# EAGLE design Lemming_SMD (EAGLE 9.5.2)
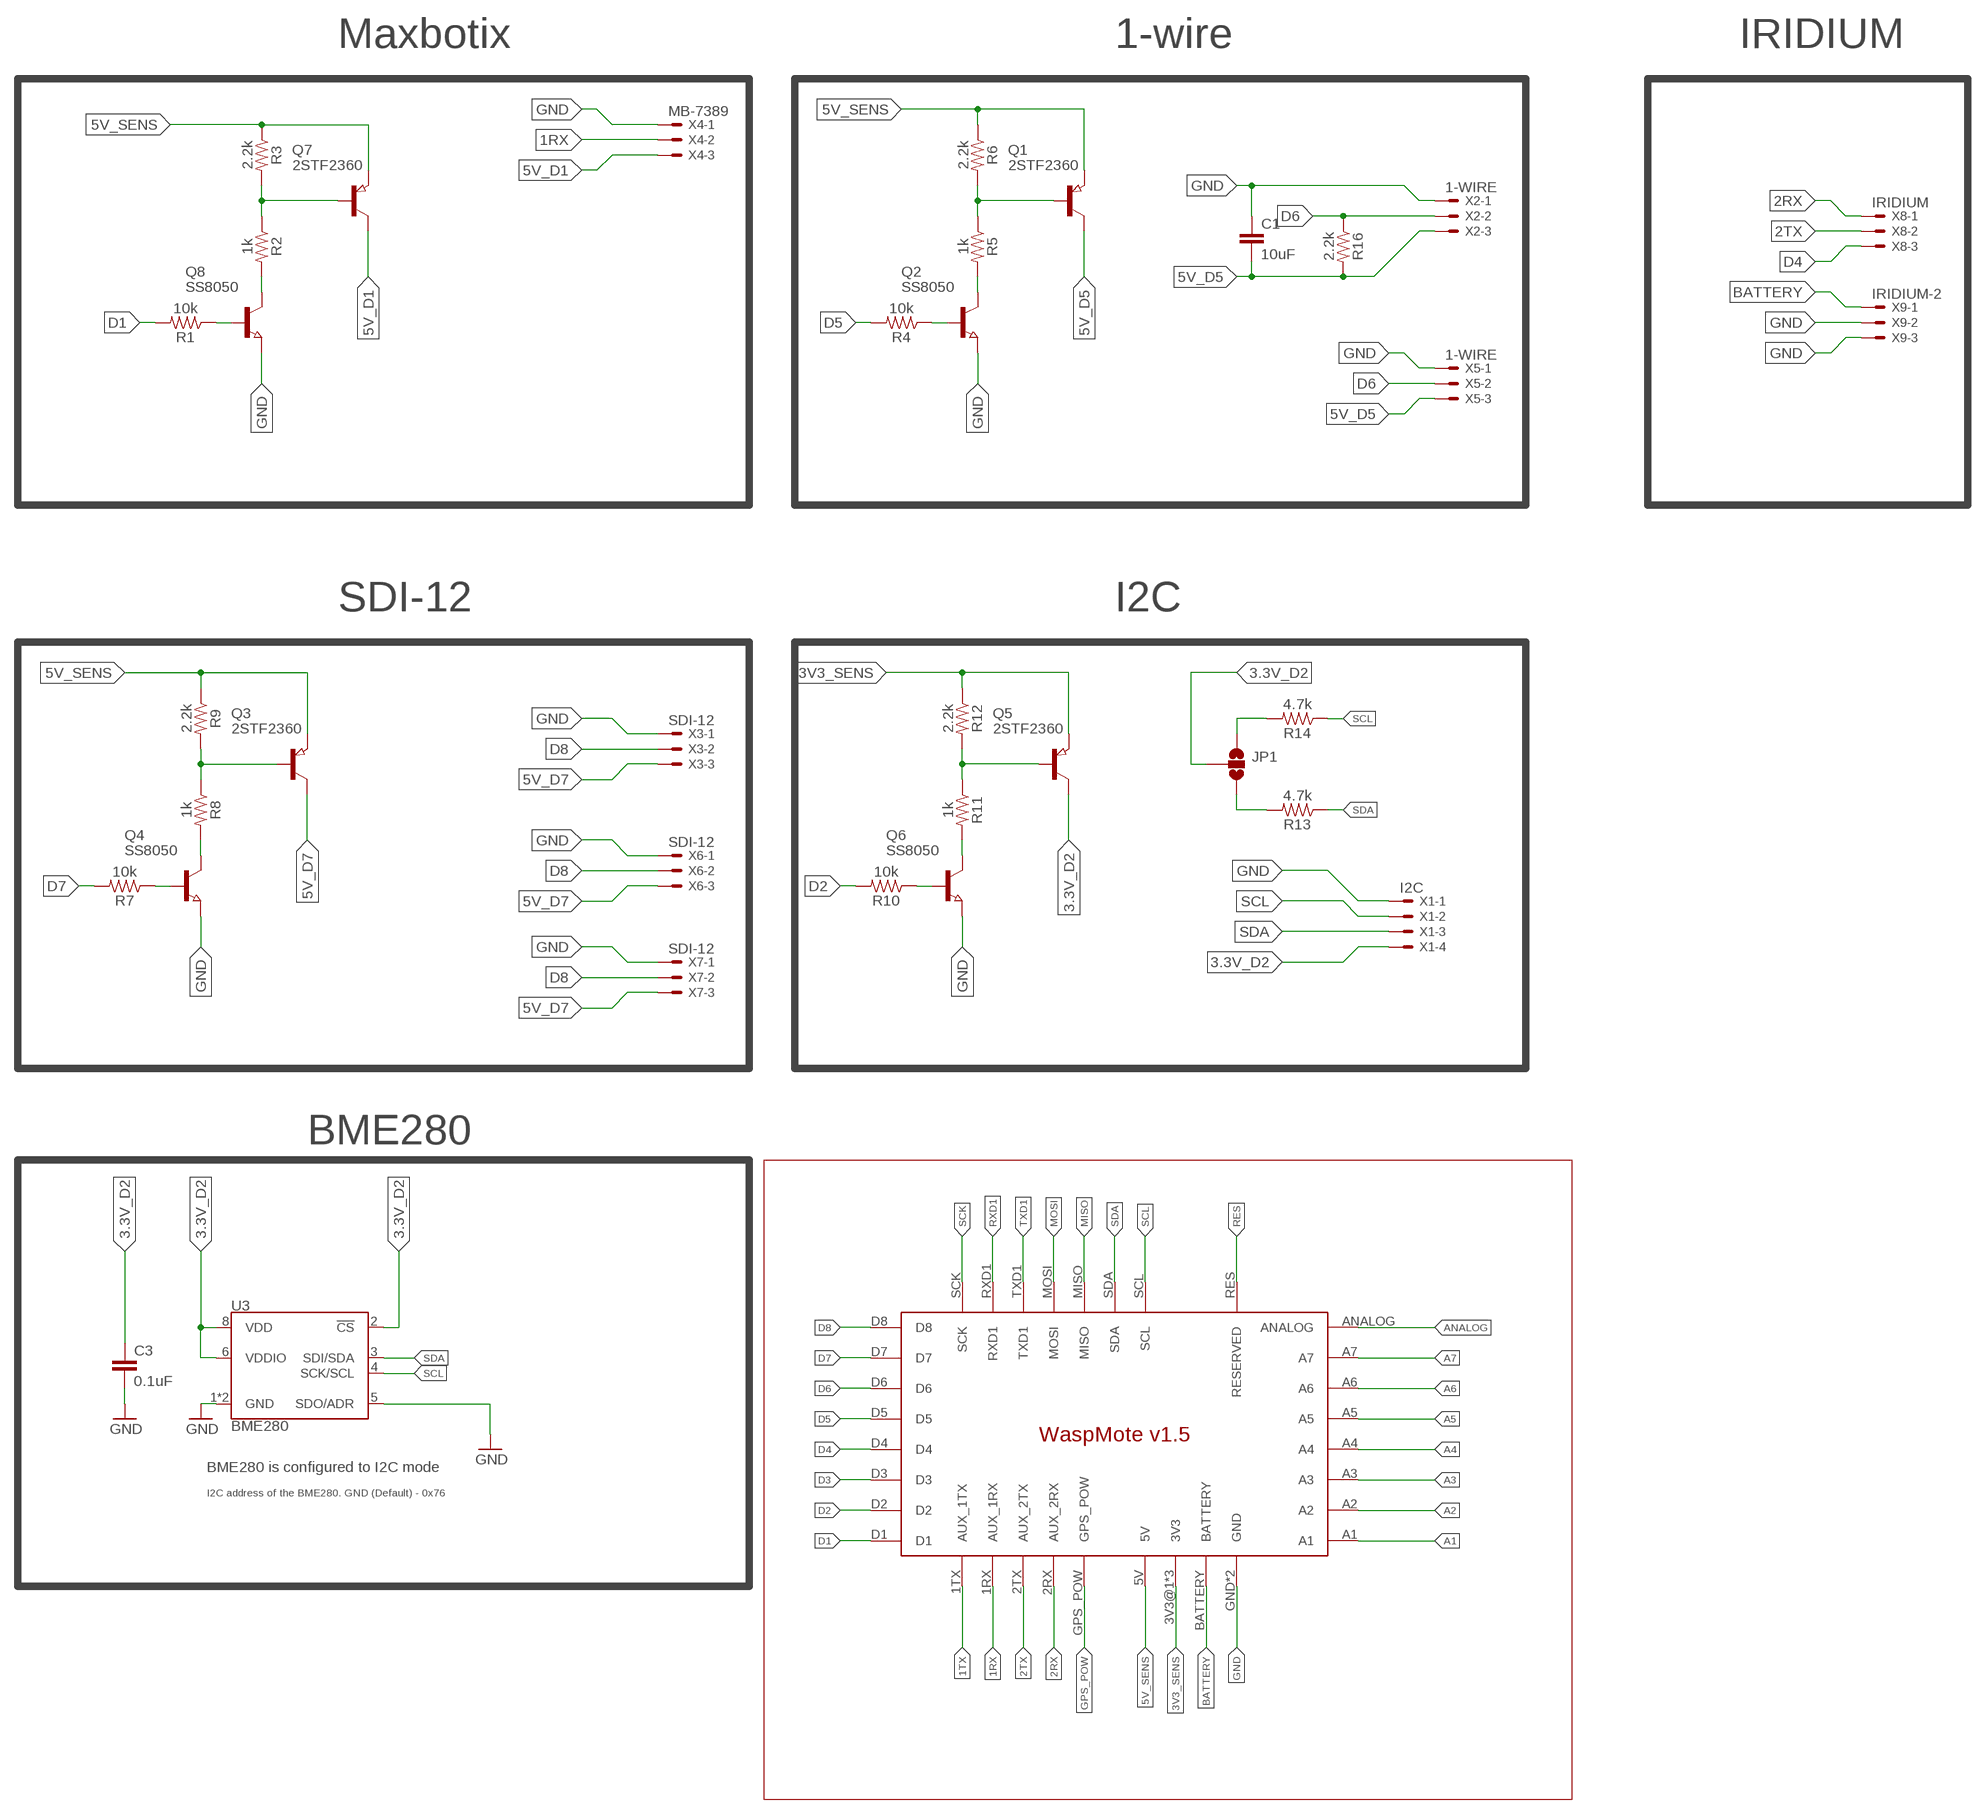
[diagram p0: schematic, sheet 1]

## Parts
C1  10uF  0.1UF-0603-25V-(+80/-20%)  [0603]
C3  0.1uF  0.1UF-0603-25V-(+80/-20%)  [0603]
JP1  JUMPER-SMT_3_NO_SILK  [SMT-JUMPER_3_NO_SILK]
Q1  2STF2360  PNP-TRANSISTOR_SOT89  [SOT89]
Q2  SS8050  NPN-TRANSISTOR_SOT23  [SOT23]
Q3  2STF2360  PNP-TRANSISTOR_SOT89  [SOT89]
Q4  SS8050  NPN-TRANSISTOR_SOT23  [SOT23]
Q5  2STF2360  PNP-TRANSISTOR_SOT89  [SOT89]
Q6  SS8050  NPN-TRANSISTOR_SOT23  [SOT23]
Q7  2STF2360  PNP-TRANSISTOR_SOT89  [SOT89]
Q8  SS8050  NPN-TRANSISTOR_SOT23  [SOT23]
R1  10k  4.7KOHM-0603-1/10W-1%  [0603]
R2  1k  4.7KOHM-0603-1/10W-1%  [0603]
R3  2.2k  4.7KOHM-0603-1/10W-1%  [0603]
R4  10k  4.7KOHM-0603-1/10W-1%  [0603]
R5  1k  4.7KOHM-0603-1/10W-1%  [0603]
R6  2.2k  4.7KOHM-0603-1/10W-1%  [0603]
R7  10k  4.7KOHM-0603-1/10W-1%  [0603]
R8  1k  4.7KOHM-0603-1/10W-1%  [0603]
R9  2.2k  4.7KOHM-0603-1/10W-1%  [0603]
R10  10k  4.7KOHM-0603-1/10W-1%  [0603]
R11  1k  4.7KOHM-0603-1/10W-1%  [0603]
R12  2.2k  4.7KOHM-0603-1/10W-1%  [0603]
R13  4.7k  4.7KOHM-0603-1/10W-1%  [0603]
R14  4.7k  4.7KOHM-0603-1/10W-1%  [0603]
R16  2.2k  4.7KOHM-0603-1/10W-1%  [0603]
U3  BME280  [LGA-8-2.5X2.5]
U$1  WASPMOTE_V1.5  [WASPMOTE_V1.5]
X1  I2C  22-23-2041  [22-23-2041]
X2  1-WIRE  22-23-2031  [22-23-2031]
X3  SDI-12  22-23-2031  [22-23-2031]
X4  MB-7389  22-23-2031  [22-23-2031]
X5  1-WIRE  22-23-2031  [22-23-2031]
X6  SDI-12  22-23-2031  [22-23-2031]
X7  SDI-12  22-23-2031  [22-23-2031]
X8  IRIDIUM  22-23-2031  [22-23-2031]
X9  IRIDIUM-2  22-23-2031  [22-23-2031]

## Nets
1RX: U$1.1RX(AUX_1RX) X4.2
1TX: U$1.1TX(AUX_1TX)
2RX: U$1.2RX(AUX_2RX) X8.1
2TX: U$1.2TX(AUX_2TX) X8.2
3.3V_D2: C3.1 JP1.2 Q5.2(C) U3.2(!CS) U3.6(VDDIO) U3.8(VDD) X1.4
3V3_SENS: Q5.3(E) R12.1 U$1.3V3@1(3V3) U$1.3V3@2(3V3) U$1.3V3@3(3V3)
5V_D1: Q7.2(C) X4.3
5V_D5: C1.2 Q1.2(C) R16.2 X2.3 X5.3
5V_D7: Q3.2(C) X3.3 X6.3 X7.3
5V_SENS: Q1.3(E) Q3.3(E) Q7.3(E) R3.1 R6.1 R9.1 U$1.5V
A1: U$1.A1
A2: U$1.A2
A3: U$1.A3
A4: U$1.A4
A5: U$1.A5
A6: U$1.A6
A7: U$1.A7
ANALOG: U$1.ANALOG
BATTERY: U$1.BATTERY X9.1
D1: R1.2 U$1.D1
D2: R10.2 U$1.D2
D3: U$1.D3
D4: U$1.D4 X8.3
D5: R4.2 U$1.D5
D6: R16.1 U$1.D6 X2.2 X5.2
D7: R7.2 U$1.D7
D8: U$1.D8 X3.2 X6.2 X7.2
GND: C1.1 C3.2 Q2.2(E) Q4.2(E) Q6.2(E) Q8.2(E) U3.1(GND) U3.5(SDO/ADR) U3.7(GND) U$1.GND U$1.GND_2(GND) X1.1 X2.1 X3.1 X4.1 X5.1 X6.1 X7.1 X9.2 X9.3
GPS_POW: U$1.GPS_POW
MISO: U$1.MISO
MOSI: U$1.MOSI
N$1: Q6.1(B) R10.1
N$2: Q6.3(C) R11.2
N$3: Q5.1(B) R11.1 R12.2
N$4: Q2.1(B) R4.1
N$5: Q1.1(B) R5.1 R6.2
N$6: JP1.3 R13.2
N$7: Q3.1(B) R8.1 R9.2
N$8: Q4.3(C) R8.2
N$9: Q4.1(B) R7.1
N$10: Q8.1(B) R1.1
N$11: Q8.3(C) R2.2
N$12: Q7.1(B) R2.1 R3.2
N$13: Q2.3(C) R5.2
N$14: JP1.1 R14.2
RES: U$1.RES(RESERVED)
RXD1: U$1.RXD1
SCK: U$1.SCK
SCL: R14.1 U3.4(SCK/SCL) U$1.SCL X1.2
SDA: R13.1 U3.3(SDI/SDA) U$1.SDA X1.3
TXD1: U$1.TXD1

## Notes on the sheet
- Maxbotix | 1-wire | IRIDIUM
- SDI-12 | I2C
- BME280
- BME280 is configured to I2C mode
- I2C address of the BME280. GND (Default) - 0x76

## Library data of the parts
C1 = SparkFun-Capacitors:0.1UF: 0.1µF ceramic capacitors A capacitor is a passive two-terminal electrical component used to store electrical energy temporarily in an electric field.; PROD_ID: CAP-00810; VALUE: 0.1uF
C3 = SparkFun-Capacitors:0.1UF: 0.1µF ceramic capacitors A capacitor is a passive two-terminal electrical component used to store electrical energy temporarily in an electric field.; PROD_ID: CAP-00810
JP1 = SparkFun-Jumpers:JUMPER-SMT_3_NO: Normally open jumper This jumper has three pads in close proximity to each other. Apply solder to close the connection(s).
Q1 Q3 Q5 Q7 = semicon-smd-ipc:PNP-TRANSISTOR_: PNP TRANSISTOR
Q2 Q4 Q6 Q8 = semicon-smd-ipc:NPN-TRANSISTOR_: NPN TRANSISTOR
R1-R12 R16 = SparkFun-Resistors:4.7KOHM: 4.7kΩ resistor A resistor is a passive two-terminal electrical component that implements electrical resistance as a circuit element. Resistors act to reduce current flow, and, at the same time, act to lower voltage levels within circuits. - Wikipedia; PROD_ID: RES-07857; VALUE: 4.7k
R13 R14 = SparkFun-Resistors:4.7KOHM: 4.7kΩ resistor A resistor is a passive two-terminal electrical component that implements electrical resistance as a circuit element. Resistors act to reduce current flow, and, at the same time, act to lower voltage levels within circuits. - Wikipedia; PROD_ID: RES-07857
U3 = SparkFun-Sensors:BME280: Bosch BME280 – Combined Humidity and Pressure Sensor The BME280 is as combined digital humidity, pressure and temperature sensor based on proven sensing principles. The sensor module is housed in an extremely compact metal-lid LGA package with a footprint of only 2.5×2.5mm² with a height of 0.93mm. Its small dimensions and its low power consumption allow the implementation in battery driven devices such as handsets, GPS modules or watches. Datasheet <https://cdn.sparkfun.com/assets/learn_tutorials/4/1/9/BST-BME280_DS001-10.pdf> SparkFun Products SparkFun Atmospheric Sensor Breakout - BME280 <https://www.sparkfun.com/products/13676> (SEN-13676); PROD_ID: IC-13090
U$1 = UIO-John:WASPMOTE_V1.5: WaspMote v1.5 (c) 2017 john.hulth@geo.uio.no
X1 = con-molex:22-23-2041: .100" (2.54mm) Center Header - 4 Pin; MF: MOLEX; MPN: 22-23-2041; OC_FARNELL: 1462920; OC_NEWARK: 38C0355
X2-X9 = con-molex:22-23-2031: .100" (2.54mm) Center Header - 3 Pin; MF: MOLEX; MPN: 22-23-2031; OC_FARNELL: 1462950; OC_NEWARK: 30C0862

## Board
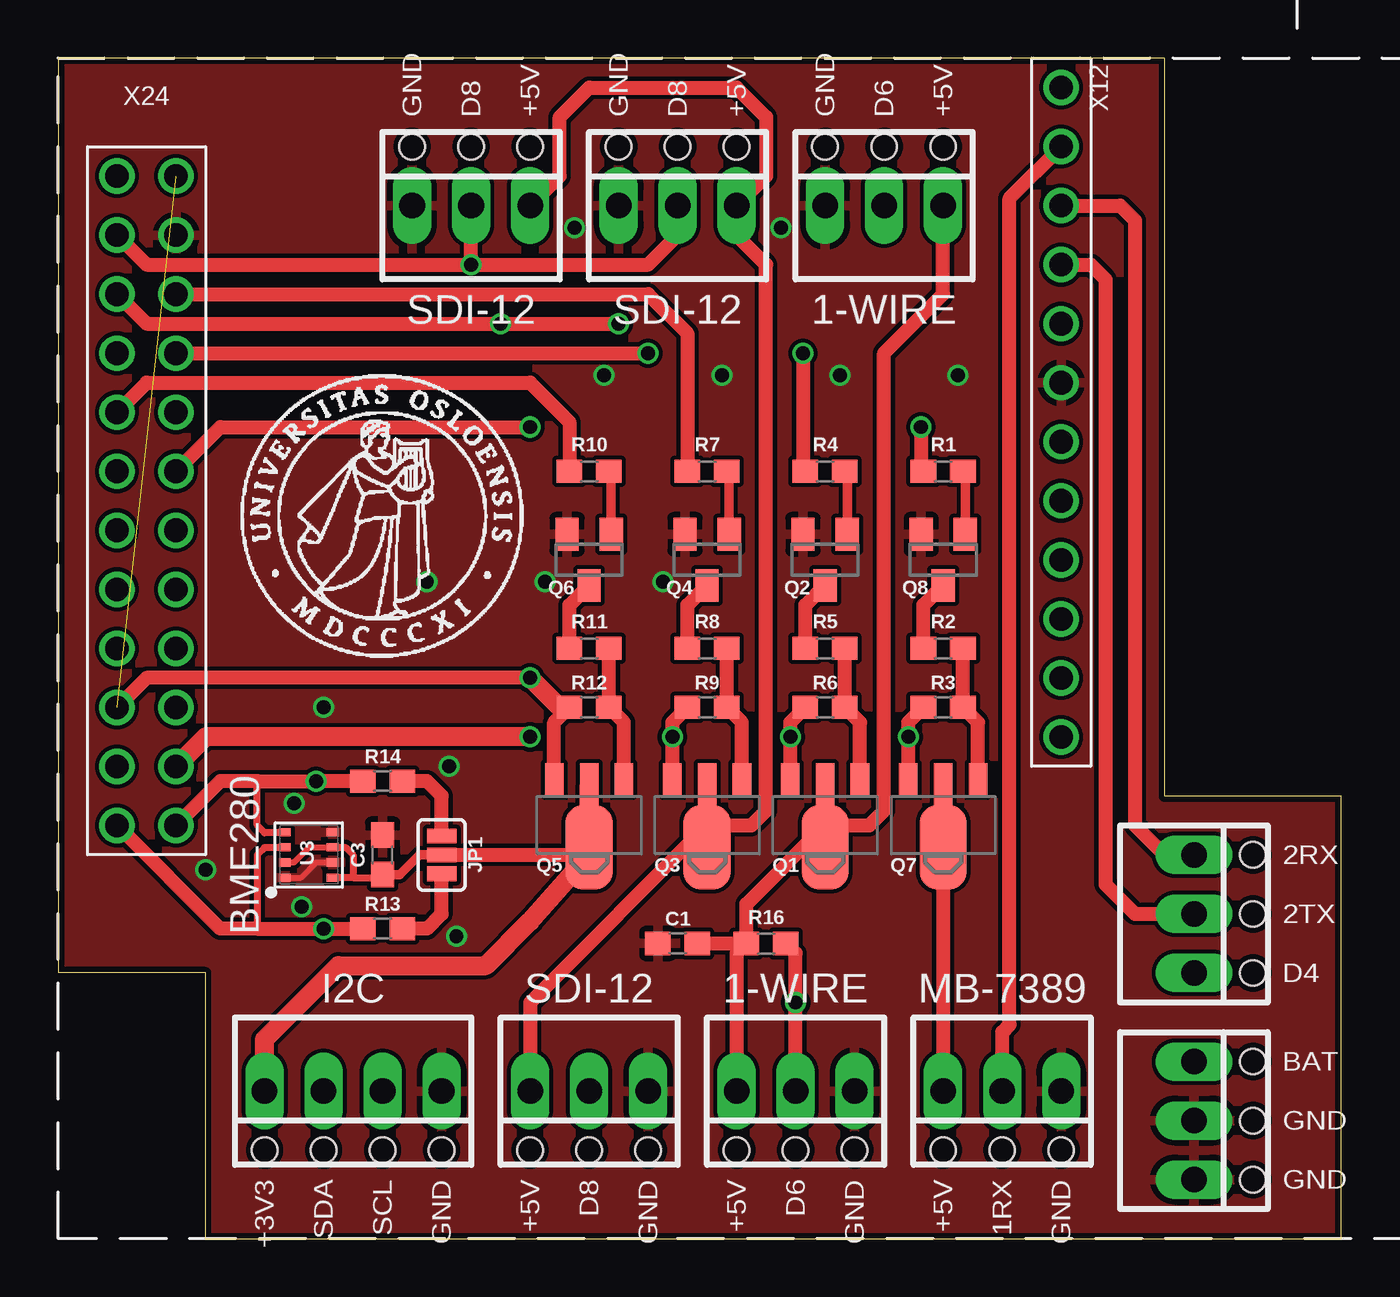
[diagram p1: board, top side]
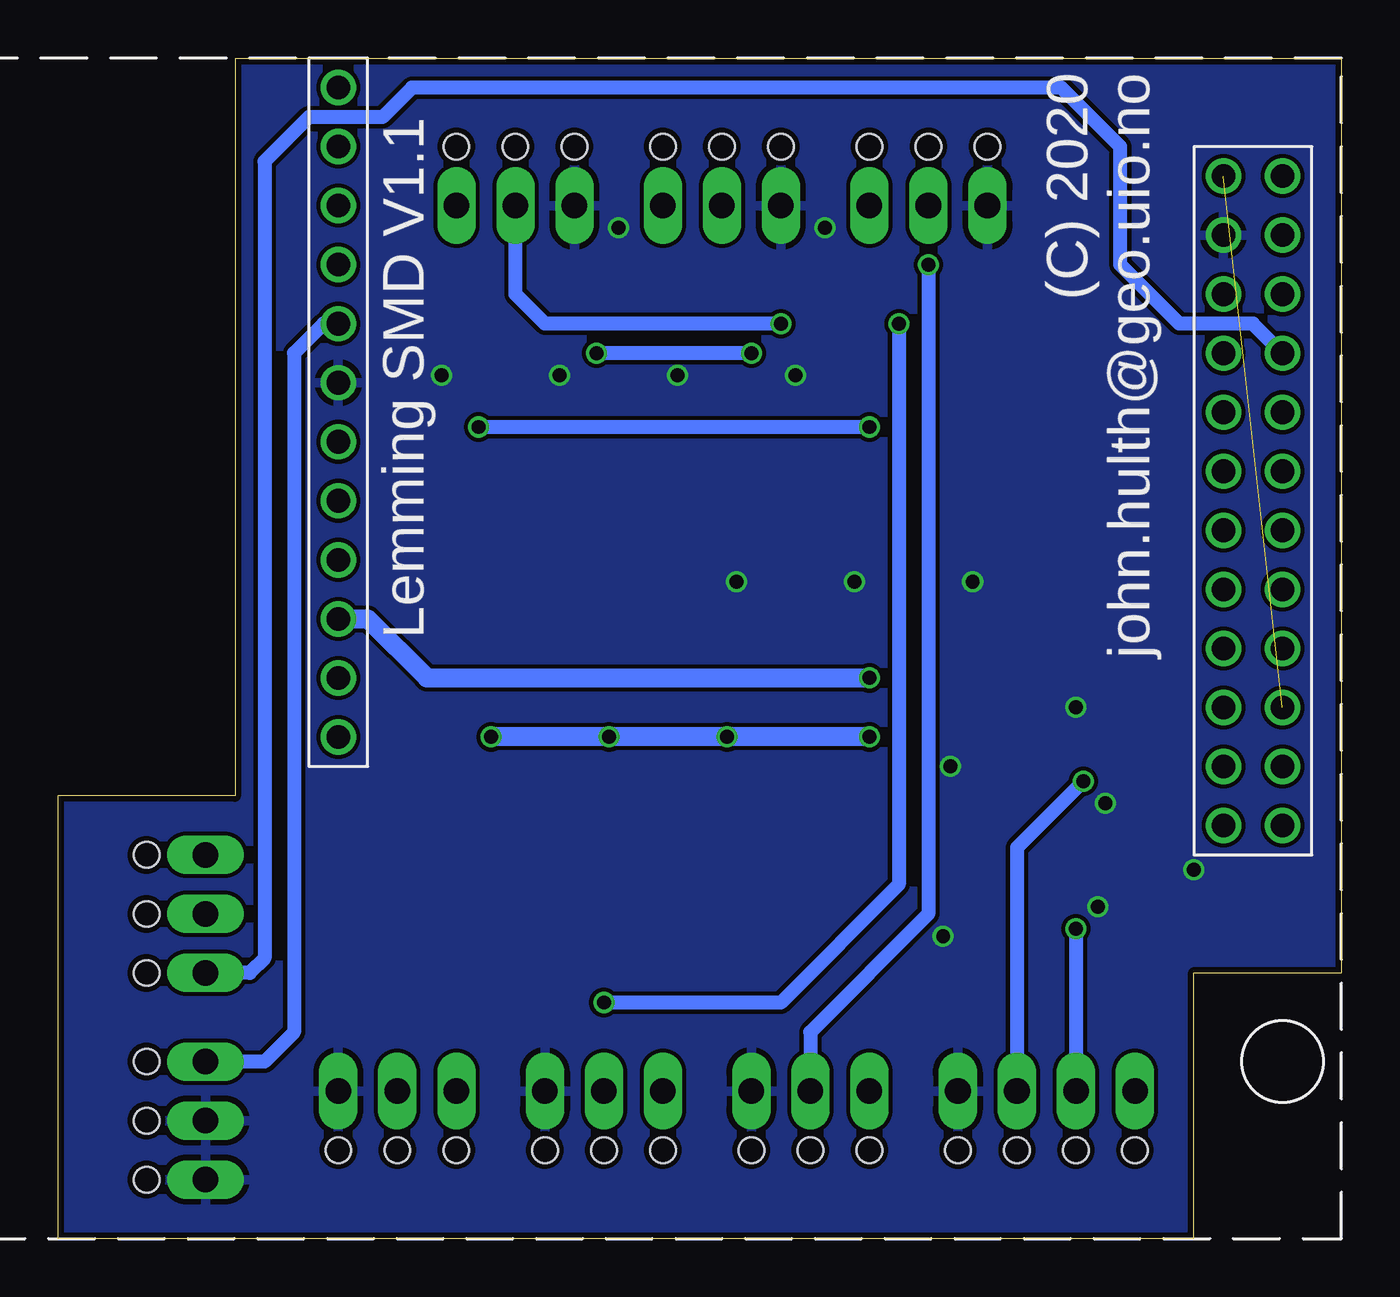
[diagram p2: board, bottom side, seen from below]

Size 55.24 x 50.8 mm. Coordinates in mm from the lower left corner, seen from the top.
Outline: 6.35,0 55.24,0 55.24,19.05 47.62,19.05 47.62,50.8 0,50.8 0,11.43 6.35,11.43 6.35,0
Copper layers (1*16): Top 0.035mm / dielectric 1.5mm / Bottom 0.035mm
Design rules "dirt_cheap_dirty_boards.v1 *": minimum track width 5mil, minimum drill 12mil, track to track 7mil, track to pad 7mil, pad to pad 7mil, via to via 7mil, smd to smd 0mil, copper to edge 10mil, drill to drill 10mil, minimum pad ring 10mil, minimum via ring 6mil, stop-mask expansion 2mil, vias tented up to drill 25mil, thermal gap 10mil

### Footprints (pad centres in the part's own frame; a part is rotated, then mirrored left to right if it is on the bottom)
0603 = smd 1.1 x 1: 1 -0.85,0; 2 0.85,0
SMT-JUMPER_3_NO_SILK = smd 0.635 x 1.27: 1 -0.813,0; 2 0,0; 3 0.813,0
SOT89 = smd 0.8 x 1.4: 1 -1.499,-1.981; 3 1.499,-1.981 | smd 0.8 x 1.9: 2 0,-1.727 | smd 2.032 x 3.65: 2@1 0,0.94
SOT23 = smd 1 x 1.4: 1 -0.95,-1.1; 2 0.95,-1.1; 3 0,1.1
LGA-8-2.5X2.5 = smd 0.35 x 0.5: 1 -0.975,1.025; 2 -0.325,1.025; 3 0.325,1.025; 4 0.975,1.025; 5 0.975,-1.025; 6 0.325,-1.025; 7 -0.325,-1.025; 8 -0.975,-1.025
WASPMOTE_V1.5 = drill 1.016: 1RX 43.18,46.99; 1TX 43.18,49.53; 2RX 43.18,44.45; 2TX 43.18,41.91; 3V3@1 5.08,45.72; 3V3@2 2.54,22.86; 3V3@3 43.18,26.67; 5V 5.08,20.32; A1 5.08,22.86; A2 2.54,25.4; A3 5.08,25.4; A4 2.54,27.94; A5 5.08,27.94; A6 2.54,30.48; A7 5.08,30.48; ANALOG 2.54,45.72; BATTERY 43.18,39.37; D1 5.08,33.02; D2 2.54,35.56; D3 5.08,35.56; D4 2.54,38.1; D5 5.08,38.1; D6 2.54,40.64; D7 5.08,40.64; D8 2.54,43.18; GND 5.08,43.18; GND_2 43.18,36.83; GPS_POW 2.54,20.32; MISO 43.18,21.59; MOSI 43.18,24.13; RES 2.54,33.02; RXD1 43.18,31.75; SCK 43.18,34.29; SCL 5.08,17.78; SDA 2.54,17.78; TXD1 43.18,29.21
22-23-2041 = drill 1.1 pad 1.422 long: 1 -3.81,0; 2 -1.27,0; 3 1.27,0; 4 3.81,0 | hole 1.1: -3.81,2.54; -1.27,2.54; 1.27,2.54; 3.81,2.54
22-23-2031 = drill 1.1 pad 1.422 long: 1 -2.54,0; 2 0,0; 3 2.54,0 | hole 1.1: -2.54,2.54; 0,2.54; 2.54,2.54

### Placement (x,y rotation side)
C1  26.67,12.7 0 top
C3  13.97,16.51 90 top
JP1  16.51,16.51 270 top
Q1  33.02,17.78 180 top
Q2  33.02,29.21 180 top
Q3  27.94,17.78 180 top
Q4  27.94,29.21 180 top
Q5  22.86,17.78 180 top
Q6  22.86,29.21 180 top
Q7  38.1,17.78 180 top
Q8  38.1,29.21 180 top
R1  38.1,33.02 180 top
R2  38.1,25.4 180 top
R3  38.1,22.86 0 top
R4  33.02,33.02 180 top
R5  33.02,25.4 180 top
R6  33.02,22.86 0 top
R7  27.94,33.02 180 top
R8  27.94,25.4 180 top
R9  27.94,22.86 0 top
R10  22.86,33.02 180 top
R11  22.86,25.4 180 top
R12  22.86,22.86 0 top
R13  13.97,13.34 0 top
R14  13.97,19.68 0 top
R16  30.48,12.7 180 top
U3  10.79,16.51 90 top
U$1  0,0 0 top
U$3  [UIO-LOGO-BL]  7.62,24.77 0 top
X1  12.7,6.35 180 top
X2  31.75,6.35 180 top
X3  22.86,6.35 180 top
X4  40.64,6.35 180 top
X5  35.56,44.45 0 top
X6  26.67,44.45 0 top
X7  17.78,44.45 0 top
X8  48.9,13.97 270 top
X9  48.9,5.08 270 top

### Tracks (layer width: path | path; a pad name or v marks a point on that pad's centre or on a via)
1RX
  Top 0.61: U$1.1RX 40.96,44.77 40.96,9.21 40.64,8.89 X4.2
2RX
  Top 0.61: X8.1 47.62,16.51 46.35,17.78 46.35,43.81 45.72,44.45 U$1.2RX
2TX
  Top 0.61: U$1.2TX 44.45,41.91 45.09,41.27 45.09,15.24 46.35,13.97 X8.2
3.3V_D2
  Top 0.254: U3.2 10.15,16.18 10.8,16.84 U3.6
  Top 0.305: 12.7,15.54 U3.8 | 12.7,15.54 13.85,15.54 C3.1 | U3.6 12.38,16.84 12.7,16.51 12.7,15.54
  Top 0.406: C3.1 14.71,15.66 15.56,16.51 JP1.2
  Top 0.61: JP1.2 22.86,16.51
  Top 0.813: X1.4 8.89,8.57 12.06,11.75 18.41,11.75 20.32,13.65 22.86,16.51 Q5.2
3V3_SENS  (via drill 0.6)  (1 unrouted)
  Top 0.61: Q5.3 21.36,22.21 R12.1 | v20.32,24.13 3.81,24.13 U$1.3V3@2
  Top 0.813: R12.1 21.59,22.86 v20.32,24.13
  Bottom 0.813: U$1.3V3@3 41.91,26.67 39.37,24.13 v20.32,24.13
5V_D1
  Top 0.61: Q7.2 X4.3
5V_D5
  Top 0.61: Q1.2 33.02,17.78 | R16.2 29.63,14.39 33.02,17.78 | R16.2 29.21,12.28 X2.3 | C1.2 R16.2 | 33.02,17.78 34.92,17.78 35.56,18.41 35.56,38.1 38.1,40.64 X5.3
5V_D7
  Top 0.61: Q3.2 27.94,17.78 | 27.94,17.78 20.32,10.16 X3.3 | 27.94,17.78 29.84,17.78 30.48,18.41 30.48,41.91 29.21,43.18 X6.3 30.48,45.72 30.48,48.26 29.21,49.53 22.86,49.53 21.59,48.26 21.59,45.72 X7.3
5V_SENS  (via drill 0.6)
  Top 0.61: Q3.3 v26.44,21.59 26.44,22.21 R9.1 | Q1.3 v31.52,21.59 31.52,22.21 R6.1 | Q7.3 v36.6,21.59 36.6,22.21 R3.1
  Top 0.813: U$1.5V 6.35,21.59 v20.32,21.59
  Bottom 0.813: v36.6,21.59 v31.52,21.59 v26.44,21.59 v20.32,21.59
BATTERY
  Bottom 0.61: U$1.BATTERY 43.81,39.37 45.09,38.1 45.09,8.89 46.35,7.62 X9.1
D1  (via drill 0.6)
  Top 0.61: U$1.D1 6.99,34.92 v20.32,34.92 | v37.15,34.92 37.15,33.12 R1.2
  Bottom 0.61: v20.32,34.92 v37.15,34.92
D2
  Top 0.61: U$1.D2 3.81,36.83 20.32,36.83 22.01,35.14 R10.2
D4
  Bottom 0.61: U$1.D4 3.81,39.37 6.99,39.37 9.53,41.91 9.53,46.99 12.06,49.53 40.01,49.53 41.27,48.26 44.45,48.26 46.35,46.35 46.35,12.06 46.99,11.43 X8.3
D5  (via drill 0.6)
  Top 0.61: U$1.D5 v25.4,38.1 | v32.07,38.1 32.07,33.02 R4.2
  Bottom 0.61: v25.4,38.1 v32.07,38.1
D6  (via drill 0.6)
  Top 0.61: X2.2 v31.75,10.16 31.75,12.28 R16.1 | U$1.D6 3.81,39.37 v19.05,39.37 v24.13,39.37
  Bottom 0.61: v19.05,39.37 19.05,15.24 24.13,10.16 v31.75,10.16 | v24.13,39.37 34.29,39.37 35.56,40.64 X5.2
D7
  Top 0.61: U$1.D7 25.4,40.64 27.09,38.95 R7.2
D8  (via drill 0.6)
  Top 0.61: U$1.D8 3.81,41.91 v17.78,41.91 | v17.78,41.91 X7.2 | v17.78,41.91 25.4,41.91 26.67,43.18 X6.2
  Bottom 0.61: v17.78,41.91 17.78,13.97 22.86,8.89 X3.2
GND  (via drill 0.6)
  Top 0.254: U3.1 10.46,15.54 11.11,16.19 U3.7
  Top 0.305: U3.7
  other vias: 10.48,14.29 10.16,18.73 22.23,43.5 31.11,43.5 33.66,37.15 28.57,37.15 23.5,37.15 38.73,37.15 20.95,28.26 26.04,28.26 15.88,28.26 11.43,22.86 6.35,15.88 16.83,20.32 17.14,13.02
  pour Bottom: 0,50.8 55.88,50.8 55.88,0 0,0
  pour Top: 0,50.8 0,0 57.15,0 57.15,50.8
N$1
  Top 0.406: R10.1 23.81,32.92 Q6.1
N$2
  Top 0.61: R11.2 22.01,27.26 Q6.3
N$3
  Top 0.61: Q5.1 24.36,22.21 R12.2 R11.1
N$4
  Top 0.406: R4.1 33.97,32.92 Q2.1
N$5
  Top 0.61: Q1.1 34.52,22.21 R6.2 R5.1
N$6
  Top 0.61: R13.2 15.88,13.34 16.51,13.97 JP1.3
N$7
  Top 0.61: Q3.1 29.44,22.21 R9.2 R8.1
N$8
  Top 0.61: R8.2 27.09,27.26 Q4.3
N$9
  Top 0.406: R7.1 28.89,32.92 Q4.1
N$10
  Top 0.406: R1.1 39.05,32.92 Q8.1
N$11
  Top 0.61: R2.2 37.25,27.26 Q8.3
N$12
  Top 0.61: Q7.1 39.6,22.21 R3.2 R2.1
N$13
  Top 0.61: R5.2 32.17,27.26 Q2.3
N$14
  Top 0.61: R14.2 15.88,19.68 16.51,19.05 JP1.1
SCL  (via drill 0.6)
  Top 0.305: U3.4 9.75,17.46 8.89,17.46 8.57,17.78 8.57,19.68
  Top 0.61: R14.1 v11.11,19.68 8.57,19.68 6.99,19.68 U$1.SCL
  Bottom 0.61: X1.2 13.97,16.83 v11.11,19.68
SDA  (via drill 0.6)
  Top 0.305: U3.3 9.76,16.83 8.89,16.83 8.57,16.51 8.57,13.34
  Top 0.61: U$1.SDA 6.99,13.34 8.57,13.34 v11.43,13.34 R13.1
  Bottom 0.61: v11.43,13.34 X1.3

### Text on the board
tNames: X24 | X12 | GND | D8 | +5V | GND | D8 | +5V | GND | D6 | +5V | 2RX | 2TX | D4 | BAT | GND | +3V3 | SDA | SCL | GND | +5V | D8 | GND | +5V | D6 | GND | +5V | 1RX | GND | GND
bNames: (C) 2020 / john.hulth@geo.uio.no | Lemming SMD V1.1